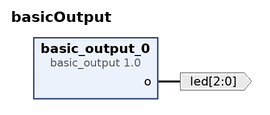
[diagram p0: block diagram of the top level]
# Vivado block design basicOutput, xc7z020clg400-1, Vivado 2022.2
create_bd_design basicOutput

create_bd_port -dir O -from 2 -to 0 -type data led

create_bd_cell -type ip -vlnv xilinx.com:hls:basic_output:1.0 basic_output_0

# ---- connections ----

connect_bd_net [get_bd_pins basic_output_0/o] [get_bd_ports led]

validate_bd_design
save_bd_design
